# Altium schematic sheet SH5 - LCD DISPLAY.SchDoc: LCD
size Letter; Author: Ayesha Ebrahim; DrawnBy: Ayesha Ebrahim; SheetNumber: 3
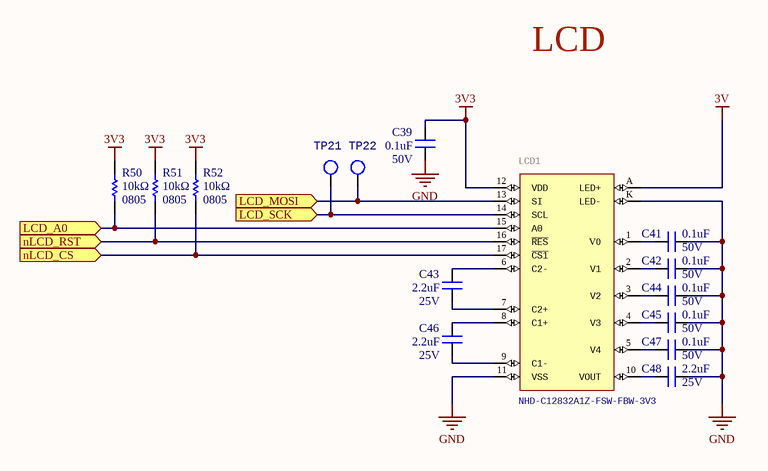
[diagram p0: SH5 - LCD DISPLAY.SchDoc]

## Parts
C39  value 0.1uF  Voltage Rating: 50V  [CAPC2012X140N]  (hidden comment: CAP_0.1uF_50V_0805)
C41  value 0.1uF  Voltage Rating: 50V  [CAPC2012X140N]  (hidden comment: CAP_0.1uF_50V_0805)
C42  value 0.1uF  Voltage Rating: 50V  [CAPC2012X140N]  (hidden comment: CAP_0.1uF_50V_0805)
C43  value 2.2uF  Voltage Rating: 25V  [CAPC2012X140N]  (hidden comment: CAP_2.2uF_25V_0805)
C44  value 0.1uF  Voltage Rating: 50V  [CAPC2012X140N]  (hidden comment: CAP_0.1uF_50V_0805)
C45  value 0.1uF  Voltage Rating: 50V  [CAPC2012X140N]  (hidden comment: CAP_0.1uF_50V_0805)
C46  value 2.2uF  Voltage Rating: 25V  [CAPC2012X140N]  (hidden comment: CAP_2.2uF_25V_0805)
C47  value 0.1uF  Voltage Rating: 50V  [CAPC2012X140N]  (hidden comment: CAP_0.1uF_50V_0805)
C48  value 2.2uF  Voltage Rating: 25V  [CAPC2012X140N]  (hidden comment: CAP_2.2uF_25V_0805)
LCD1  NHD-C12832A1Z-FSW-FBW-3V3  [NHDC12832A1ZFSWFBW3V3]
R50  value 10kΩ  Case Code (Imperial): 0805  [RESC2012X60N]  (hidden comment: RES_10kΩ_0805)
R51  value 10kΩ  Case Code (Imperial): 0805  [RESC2012X60N]  (hidden comment: RES_10kΩ_0805)
R52  value 10kΩ  Case Code (Imperial): 0805  [RESC2012X60N]  (hidden comment: RES_10kΩ_0805)
TP21  TESTPOINT_LOOP  [TESTPOINT_LOOP]  (value not drawn)
TP22  TESTPOINT_LOOP  [TESTPOINT_LOOP]  (value not drawn)

## Ports
LCD_A0 (in), LCD_MOSI (in), LCD_SCK (in), nLCD_CS (in), nLCD_RST (in)

## Nets
3V: LCD1.A(LED+)
3V3: C39.1 LCD1.12(VDD) R50.2 R51.2 R52.2
GND: C39.2 C41.1 C42.1 C44.1 C45.1 C47.1 C48.1 LCD1.11(VSS) LCD1.K(LED-)
LCD_A0: LCD1.15(A0) R50.1 ; port LCD_A0
LCD_MOSI: LCD1.13(SI) TP22.1 ; port LCD_MOSI
LCD_SCK: LCD1.14(SCL) TP21.1 ; port LCD_SCK
nLCD_CS: LCD1.17(~{CS1}) R52.1 ; port nLCD_CS
nLCD_RST: LCD1.16(~{RES}) R51.1 ; port nLCD_RST
NetC41_2: C41.2 LCD1.1(V0)
NetC42_2: C42.2 LCD1.2(V1)
NetC43_1: C43.1 LCD1.7(C2+)
NetC43_2: C43.2 LCD1.6(C2-)
NetC44_2: C44.2 LCD1.3(V2)
NetC45_2: C45.2 LCD1.4(V3)
NetC46_1: C46.1 LCD1.9(C1-)
NetC46_2: C46.2 LCD1.8(C1+)
NetC47_2: C47.2 LCD1.5(V4)
NetC48_2: C48.2 LCD1.10(VOUT)

## Notes on the sheet
- LCD
- Title
- Size:
- Date:
- Letter
- Drawn By:
- Sheet
- of
- File:

## Library data of the parts
C39 C41 C42 C44 C45 C47 = CAP_0.1uF_50V_0805: CAP CER 0.1UF 50V X7R 0805; Manufacturer 1: Murata Electronics; Manufacturer Part Number 1: GCD21BR71H104KA01L; Capacitance: 100nF; Tolerance: 10%; Mount: Surface Mount; Case/Package: 0805; Case Code (Metric): 2012; Case Code (Imperial): 0805; Min Operating Temperature: -55°C; Max Operating Temperature: 125°C; Dielectric: X7R; Termination: SMD/SMT; Length: 2mm; Height: 1.25mm; Width: 0.049inch; Thickness: 0.049inch; Depth: 1.25mm; Ratings: AEC-Q200; ComponentLink1URL: https://datasheet.ciiva.com/29537/c03e-29537701.pdf?src-supplier=Digi-Key; ComponentLink1Description: https://datasheet.ciiva.com/29537/c03e-29537701.pdf?src-supplier=Digi-Key; Supplier 1: Digi-Key; Supplier Part Number 1: 490-11955-1-ND
C43 C46 C48 = CAP_2.2uF_25V_0805: CAP CER 2.2UF 25V X7R 0805; Manufacturer 1: Murata Electronics; Manufacturer Part Number 1: GRM21BR71E225KA73L; Capacitance: 2200nF; Tolerance: 10%; Mount: Surface Mount; Case/Package: 0805; Case Code (Metric): 2012; Case Code (Imperial): 0805; Min Operating Temperature: -55°C; Max Operating Temperature: 125°C; Dielectric: X7R; Termination: SMD/SMT; Length: 2mm; Height: 1.25mm; Width: 0.049inch; Thickness: 0.049inch; Depth: 1.25mm; Ratings: AEC-Q200; Supplier 1: Digi-Key; Supplier Part Number 1: 490-3331-2-ND
LCD1 = NHD-C12832A1Z-FSW-FBW-3V3: LCD COG GRAPHIC 128X32; Manufacturer 1: Newhaven Display Intl; Supplier 1: Digi-Key; Supplier Part Number 1: NHD-C12832A1Z-FSW-FBW-3V3-ND; Manufacturer Part Number 1: NHD-C12832A1Z-FSW-FBW-3V3
R50-R52 = RES_10kΩ_0805: RES SMD 10K OHM 1% 1/8W 0805; Manufacturer 1: Yageo; Manufacturer Part Number 1: RC0805FR-0710KL; Power Rating: 125mW; Supplier 1: Digi-Key; Case Code (Metric): 2012; Min Operating Temperature: -55°C; Max Operating Temperature: 155°C; Resistance: 10K; Tolerance: 1%; Termination: SMD/SMT; Supplier Part Number 1: 311-10.0KCRCT-ND
TP21 TP22 = TESTPOINT_LOOP: Loop testpoint through-hole pad; Manufacturer Part Number 1: 5002; Manufacturer 1: Keystone Electronics; Supplier Part Number 1: 36-5002-ND; Supplier 1: Digi-Key; Mount: Through Hole